# EAGLE design rutten_motor_board (EAGLE 6.5.0)
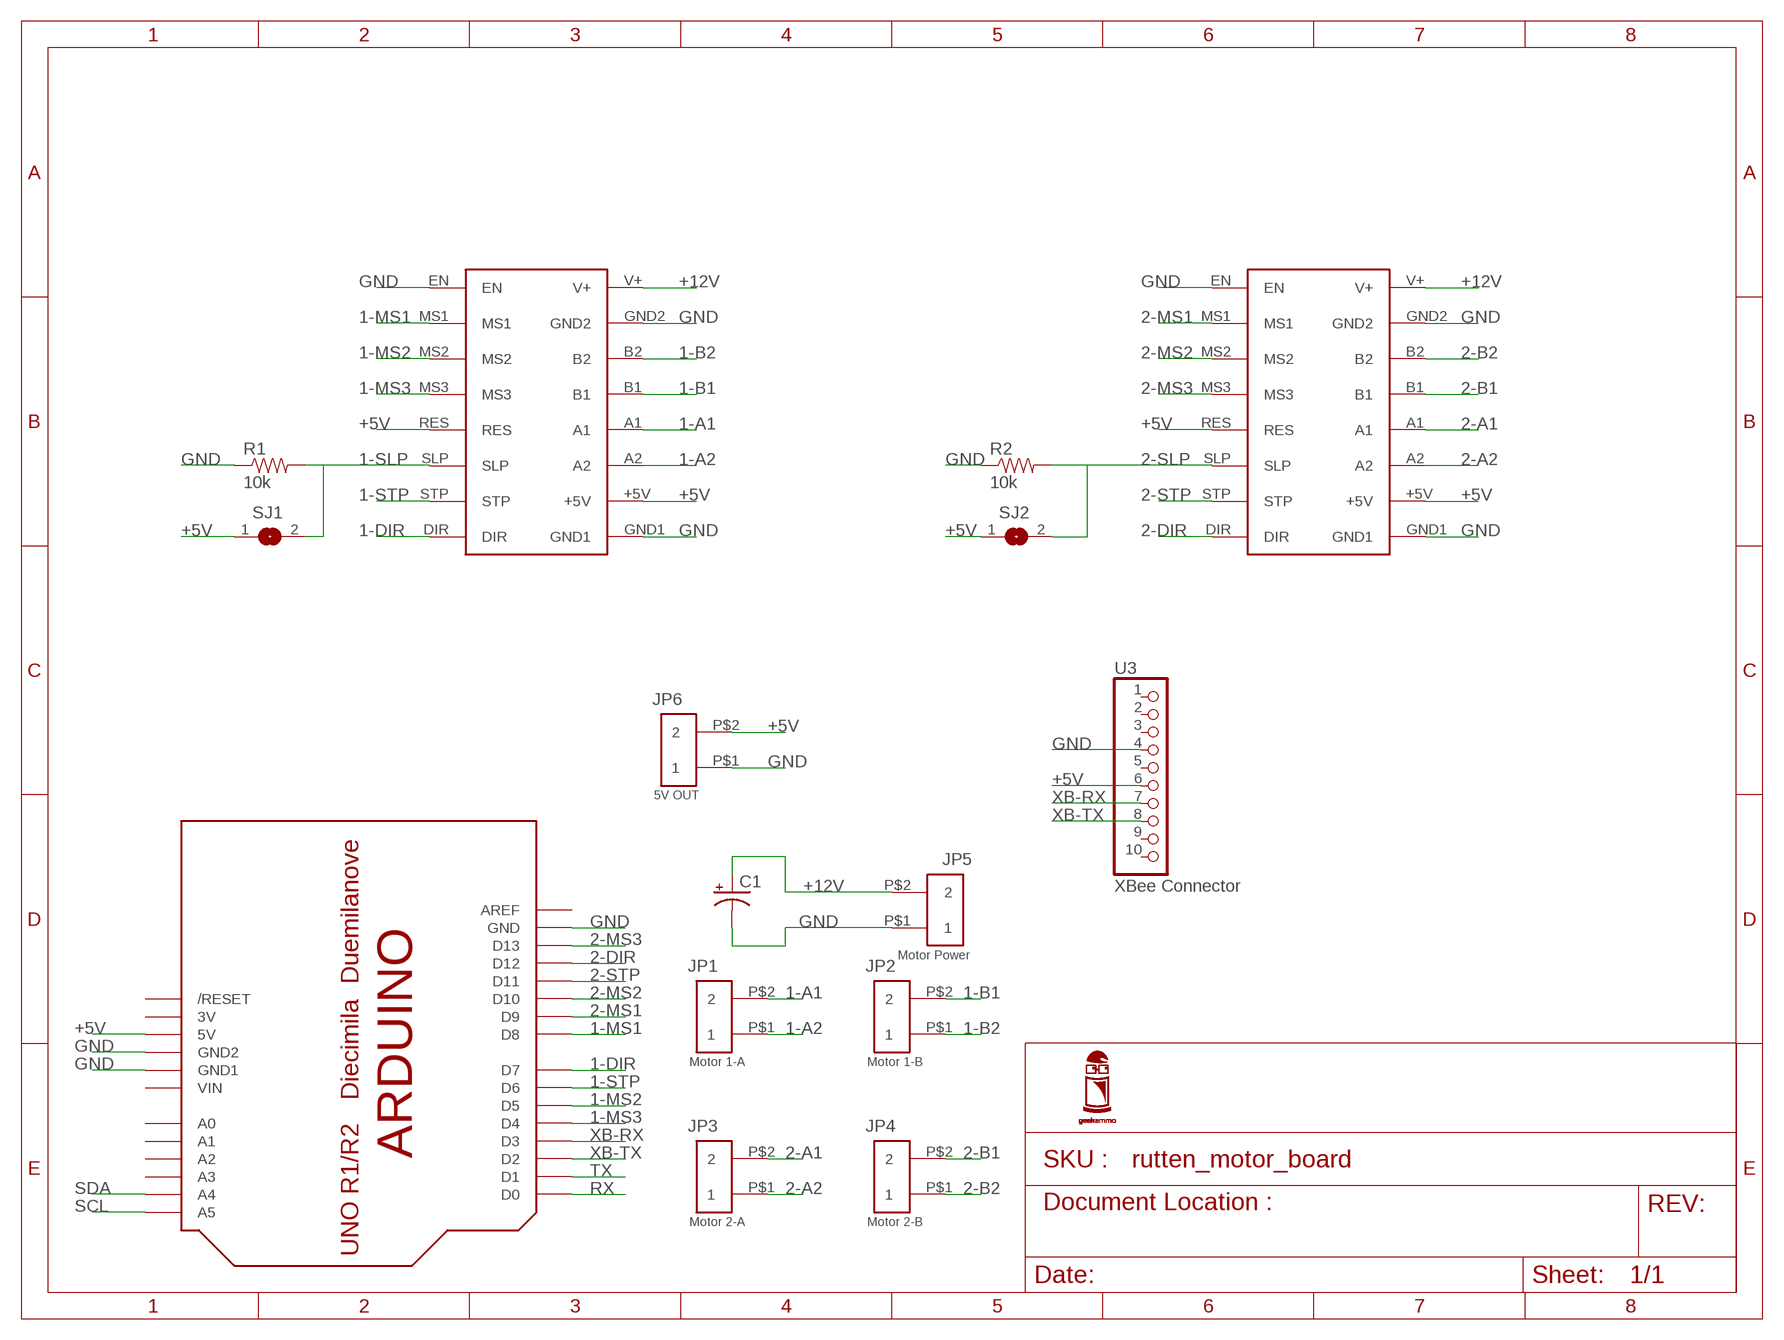
[diagram p0: schematic, sheet 1]

## Parts
C1  CAP_POLPTH2  [CPOL-RADIAL-10UF-25V]
JP1  Motor 1-A  SCREWTERM-2  [SCREW_TERM-200MIL-2]
JP2  Motor 1-B  SCREWTERM-2  [SCREW_TERM-200MIL-2]
JP3  Motor 2-A  SCREWTERM-2  [SCREW_TERM-200MIL-2]
JP4  Motor 2-B  SCREWTERM-2  [SCREW_TERM-200MIL-2]
JP5  Motor Power  SCREWTERM-2  [SCREW_TERM-200MIL-2]
JP6  5V OUT  SCREWTERM-2  [SCREW_TERM-200MIL-2]
R1  10k  RESISTORPTH-1/4W  [AXIAL-0.4]
R2  10k  RESISTORPTH-1/4W  [AXIAL-0.4]
SJ1  SJ  [SJ]
SJ2  SJ  [SJ]
U1  A4988_STEP_STICK  [A9488_STEP_STICK]
U2  A4988_STEP_STICK  [A9488_STEP_STICK]
U3  XBee Connector  PINHD-1X10  [1X10-BIG]
U$1  ARDUINOUNO  [ARDUINO]

## Nets
1-A1: JP1.P$2 U1.A1
1-A2: JP1.P$1 U1.A2
1-B1: JP2.P$2 U1.B1
1-B2: JP2.P$1 U1.B2
1-DIR: U1.DIR U$1.D7
1-MS1: U1.MS1 U$1.D8
1-MS2: U1.MS2 U$1.D5
1-MS3: U1.MS3 U$1.D4
1-SLP: R1.P$2 SJ1.2 U1.SLP
1-STP: U1.STP U$1.D6
2-A1: JP3.P$2 U2.A1
2-A2: JP3.P$1 U2.A2
2-B1: JP4.P$2 U2.B1
2-B2: JP4.P$1 U2.B2
2-DIR: U2.DIR U$1.D12
2-MS1: U2.MS1 U$1.D9
2-MS2: U2.MS2 U$1.D10
2-MS3: U2.MS3 U$1.D13
2-SLP: R2.P$2 SJ2.2 U2.SLP
2-STP: U2.STP U$1.D11
+5V: JP6.P$2 SJ1.1 SJ2.1 U1.+5V U1.RES U2.+5V U2.RES U3.6 U$1.5V
+12V: C1.1(+) JP5.P$2 U1.V+ U2.V+
GND: C1.2(-) JP5.P$1 JP6.P$1 R1.P$1 R2.P$1 U1.EN U1.GND1 U1.GND2 U2.EN U2.GND1 U2.GND2 U3.4 U$1.GND U$1.GND1 U$1.GND2
RX: U$1.D0
SCL: U$1.A5
SDA: U$1.A4
TX: U$1.D1
XB-RX: U3.7 U$1.D3
XB-TX: U3.8 U$1.D2
Unconnected: U3.1 U3.2 U3.3 U3.5 U3.9 U3.10 U$1.A0 U$1.A1 U$1.A2 U$1.A3 U$1.AREF U$1.RESET(/RESET)

## Power pins joined to a net without a drawn wire
5V: U$1.3V
VIN: U$1.VIN

## Library data of the parts
C1 = SparkFun-Passives:CAP_POL: Capacitor Polarized These are standard SMD and PTH capacitors. Normally 10uF, 47uF, and 100uF in electrolytic and tantalum varieties. Always verify the external diameter of the through hole cap, it varies with capacity, voltage, and manufacturer. The EIA devices should be standard.
JP1-JP6 = screwterms:SCREWTERM-2
R1 R2 = SparkFun-Passives:RESISTOR: Resistor Basic schematic elements and footprints for 0603, 1206, and PTH resistors.
SJ1 SJ2 = jumper:SJ: SMD solder JUMPER
U1 U2 = Custom:A4988_STEP_STICK
U3 = adafruit:PINHD-1X10: Pin header 1x10 0.1" spacing With round pins
U$1 = adafruit:ARDUINO: Arduino Diecimila/Duemilanove Make a shield with ease, this package has all the named pins as well as the two mounting drill holes and an outline of the USB and DC power connector. The outline is on the DIMENSION layer, so if your board house uses it they will cut the outline to match. http://www.ladyada.net/library/pcb/eaglelibrary.html

## Board
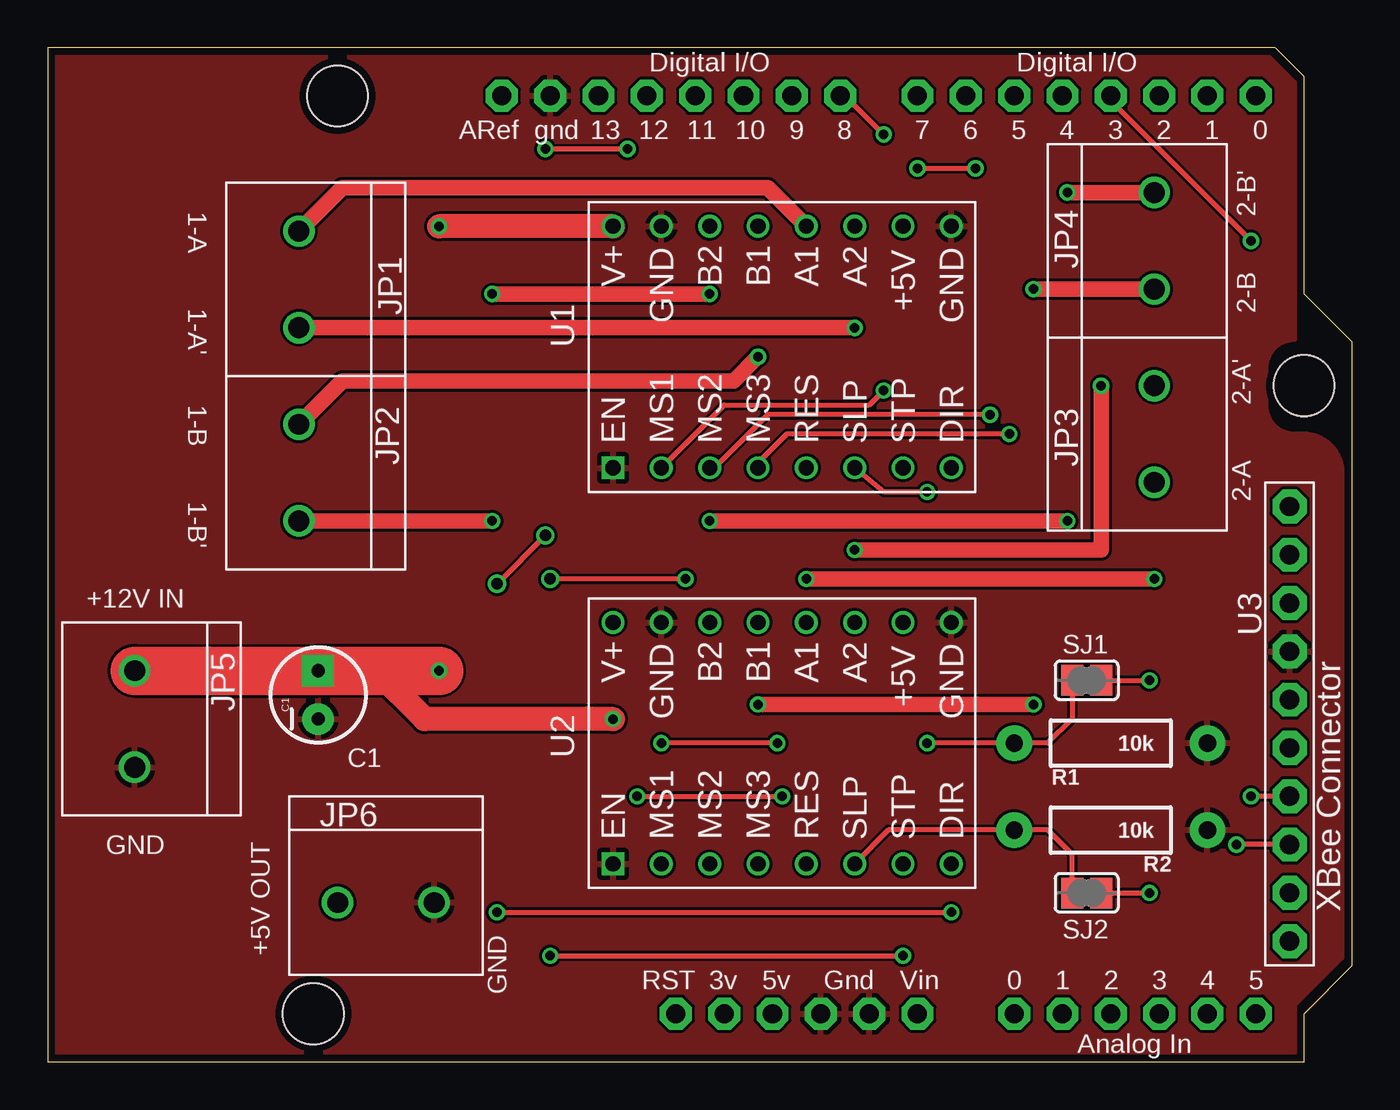
[diagram p1: board, top side]
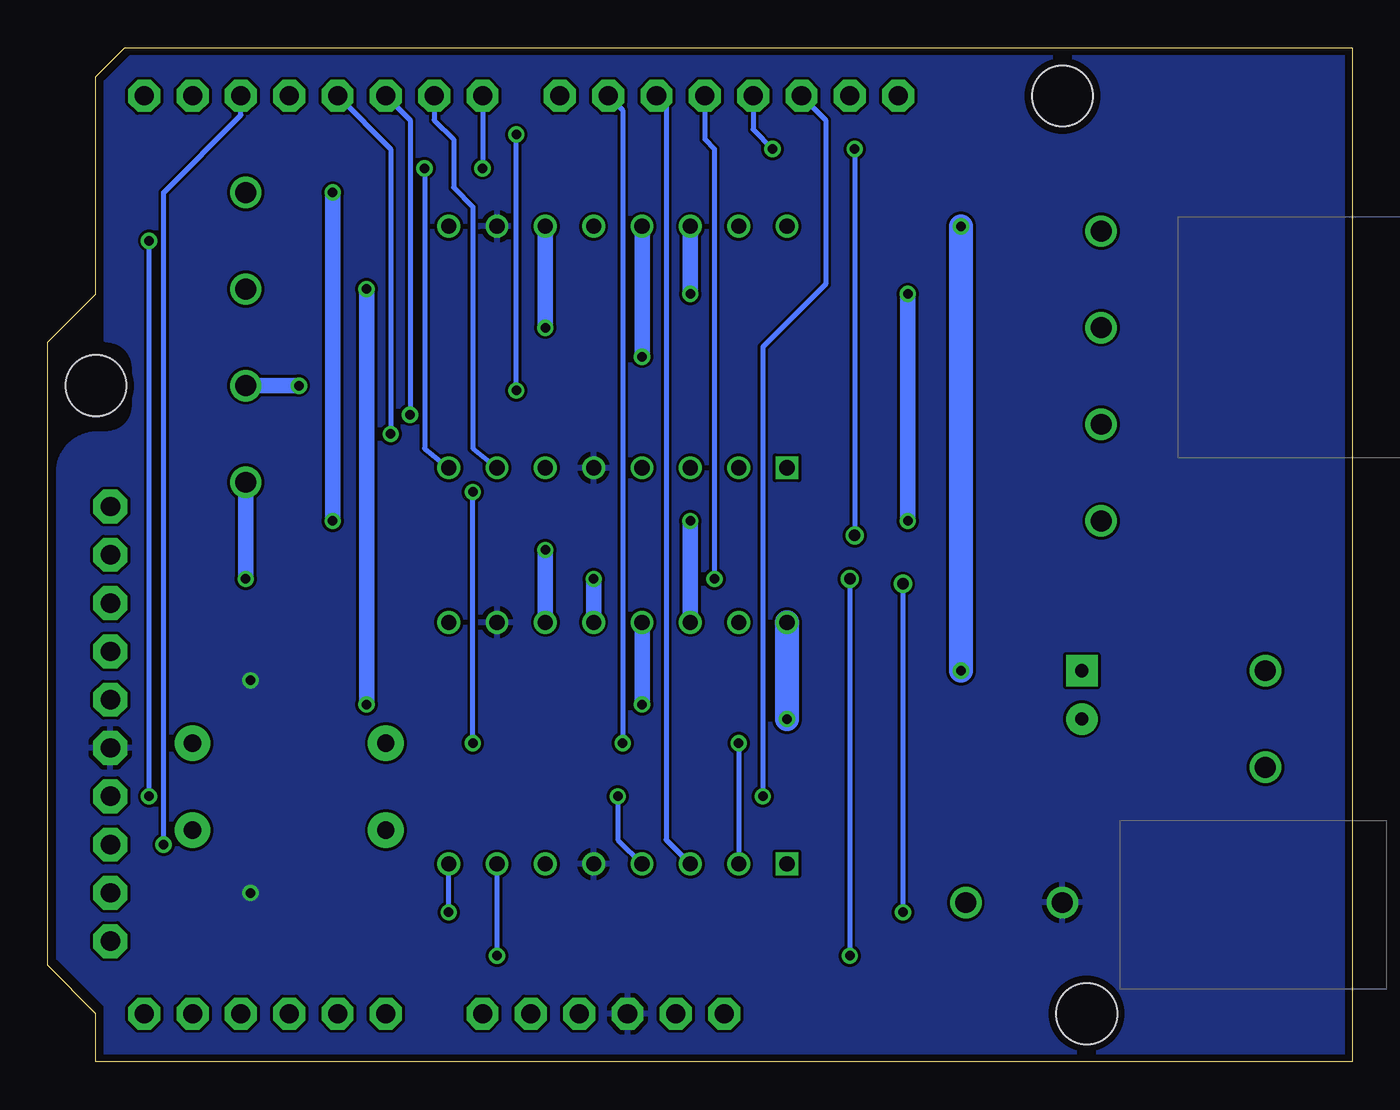
[diagram p2: board, bottom side, seen from below]

Size 68.58 x 53.34 mm. Coordinates in mm from the lower left corner, seen from the top.
Copper layers (1*16): Top 0.0356mm / dielectric 1.5011mm / Bottom 0.0356mm
Design rules "oshpark-2layer *": minimum track width 6mil, minimum drill 13mil, track to track 6mil, track to pad 6mil, pad to pad 6mil, via to via 6mil, smd to smd 6mil, copper to edge 15mil, drill to drill 6mil, minimum pad ring 7mil, minimum via ring 7mil, stop-mask expansion 2.5mil, vias tented up to drill 17mil, thermal gap 10mil

### Footprints (pad centres in the part's own frame; a part is rotated, then mirrored left to right if it is on the bottom)
CPOL-RADIAL-10UF-25V = drill 0.7 pad 1.651 square: 1 1.27,0 | drill 0.7 pad 1.651: 2 -1.27,0
SCREW_TERM-200MIL-2 = drill 1.1: P$1 2.54,0; P$2 -2.54,0
AXIAL-0.4 = drill 0.9 pad 1.88: P$1 -5.08,0; P$2 5.08,0
SJ = smd 1.168 x 1.6: 1 -0.762,0; 2 0.762,0
A9488_STEP_STICK = drill 0.8: +5V 6.35,-6.35; A1 6.35,-1.27; A2 6.35,-3.81; B1 6.35,1.27; B2 6.35,3.81; DIR -6.35,-8.89; GND1 6.35,-8.89; GND2 6.35,6.35; MS1 -6.35,6.35; MS2 -6.35,3.81; MS3 -6.35,1.27; RES -6.35,-1.27; SLP -6.35,-3.81; STP -6.35,-6.35; V+ 6.35,8.89 | drill 0.8 square: EN -6.35,8.89
1X10-BIG = drill 1.016 pad 1.778 octagon: 1 -11.43,0; 2 -8.89,0; 3 -6.35,0; 4 -3.81,0; 5 -1.27,0; 6 1.27,0; 7 3.81,0; 8 6.35,0; 9 8.89,0; 10 11.43,0
ARDUINO = drill 1 pad 1.676 octagon: 3V 35.56,2.54; 5V 38.1,2.54; A0 50.8,2.54; A1 53.34,2.54; A2 55.88,2.54; A3 58.42,2.54; A4 60.96,2.54; A5 63.5,2.54; AREF 23.876,50.8; D0 63.5,50.8; D1 60.96,50.8; D2 58.42,50.8; D3 55.88,50.8; D4 53.34,50.8; D5 50.8,50.8; D6 48.26,50.8; D7 45.72,50.8; D8 41.656,50.8; D9 39.116,50.8; D10 36.576,50.8; D11 34.036,50.8; D12 31.496,50.8; D13 28.956,50.8; GND 26.416,50.8; GND1 43.18,2.54; GND2 40.64,2.54; RESET 33.02,2.54; VIN 45.72,2.54 | hole 3.2: 15.24,50.8; 66.04,35.56; 13.97,2.54

### Placement (x,y rotation side)
C1  14.22,19.3 90 top
JP1  13.21,41.15 270 top
JP2  13.21,30.99 270 top
JP3  58.17,33.02 90 top
JP4  58.17,43.18 90 top
JP5  4.57,18.03 270 top
JP6  17.78,8.38 0 top
R1  55.88,16.76 180 top
R2  55.88,12.19 180 top
SJ1  54.61,20.07 180 top
SJ2  54.61,8.89 180 top
U1  38.61,37.59 90 top
U2  38.61,16.76 90 top
U3  65.28,17.78 270 top
U$1  0,0 0 top

### Tracks (layer width: path | path; a pad name or v marks a point on that pad's centre or on a via)
1-A1
  Top 0.813: JP1.P$2 15.49,45.97 37.85,45.97 U1.A1
1-A2  (via drill 0.5)
  Top 0.813: JP1.P$1 v42.42,38.61
  Bottom 0.813: v42.42,38.61 U1.A2
1-B1  (via drill 0.5)
  Top 0.813: JP2.P$2 15.49,35.81 36.07,35.81 v37.34,37.08
  Bottom 0.813: v37.34,37.08 U1.B1
1-B2  (via drill 0.5)
  Top 0.813: v34.8,40.39 v23.37,40.39 | v23.37,28.45 JP2.P$1
  Bottom 0.813: U1.B2 v34.8,40.39 | v23.37,40.39 v23.37,28.45
1-DIR  (via drill 0.5 pad 0.41)
  Top 0.254: v45.72,46.99 v48.77,46.99
  Bottom 0.254: U$1.D7 v45.72,46.99 | v48.77,46.99 48.77,32.26 U1.DIR
1-MS1  (via drill 0.5 pad 0.41)
  Top 0.254: U1.MS1 35.56,34.54 43.18,34.54 v43.94,35.31 | v43.94,48.77 41.91,50.8 U$1.D8
  Bottom 0.254: v43.94,35.31 v43.94,48.77
1-MS2  (via drill 0.5)
  Top 0.254: v49.53,34.04 37.85,34.04 35.05,31.24 U1.MS2
  Bottom 0.254: U$1.D5 49.53,49.53 v49.53,34.04
1-MS3  (via drill 0.5)
  Top 0.254: v50.55,33.02 38.86,33.02 37.34,31.5 U1.MS3
  Bottom 0.254: U$1.D4 50.55,48.01 v50.55,33.02
1-SLP  (via drill 0.5 pad 0.41)
  Top 0.254: v46.23,16.76 R1.P$2 52.58,16.76 53.85,18.03 SJ1.2 | v46.23,29.97 43.94,29.97 U1.SLP
  Bottom 0.254: v46.23,16.76 v46.23,29.97
1-STP
  Bottom 0.254: U1.STP 46.23,32.26 46.23,44.96 47.24,45.97 47.24,48.51 48.26,49.53 U$1.D6
2-A1  (via drill 0.5)
  Top 0.813: v58.17,25.4 v39.88,25.4
  Bottom 0.813: JP3.P$2 v58.17,25.4 | v39.88,25.4 U2.A1
2-A2  (via drill 0.5, 0.5 pad 0.41)
  Top 0.813: v42.42,26.92 55.37,26.92 v55.37,35.56
  Bottom 0.813: v42.42,26.92 U2.A2 | v55.37,35.56 JP3.P$1
2-B1  (via drill 0.5 pad 0.41)
  Top 0.813: v51.82,18.8 v37.34,18.8 | JP4.P$2 v51.82,40.64
  Bottom 0.813: v51.82,40.64 v51.82,18.8 | v37.34,18.8 U2.B1
2-B2  (via drill 0.5, 0.5 pad 0.41)
  Top 0.813: v53.59,28.45 v34.8,28.45 | JP4.P$1 v53.59,45.72
  Bottom 0.813: v53.59,45.72 v53.59,28.45 | v34.8,28.45 U2.B2
2-DIR  (via drill 0.5 pad 0.41, 0.6, 0.6 pad 0.41)
  Top 0.254: v30.48,48.01 v26.16,48.01 | v23.62,7.87 v47.5,7.87 | v26.16,27.69 v23.62,25.15
  Bottom 0.254: U$1.D12 31.5,49.02 v30.48,48.01 | v26.16,48.01 v26.16,27.69 | v23.62,25.15 v23.62,7.87 | v47.5,7.87 U2.DIR
2-MS1  (via drill 0.5)
  Top 0.254: v38.35,16.76 v32.26,16.76
  Bottom 0.254: U$1.D9 38.35,50.04 v38.35,16.76 | v32.26,16.76 U2.MS1
2-MS2
  Bottom 0.254: U$1.D10 36.07,50.29 36.07,11.68 U2.MS2
2-MS3  (via drill 0.5)
  Top 0.254: v30.99,13.97 v38.61,13.97
  Bottom 0.254: U$1.D13 27.69,49.53 27.69,40.89 30.99,37.59 v30.99,13.97 | v38.61,13.97 38.61,11.68 U2.MS3
2-SLP
  Top 0.254: U2.SLP 44.2,12.19 R2.P$2 52.58,12.19 53.85,10.92 SJ2.2
2-STP  (via drill 0.5 pad 0.41, 0.6 pad 0.41)
  Top 0.254: v33.53,25.4 v26.42,25.4 | v26.42,5.59 v44.96,5.59
  Bottom 0.254: U$1.D11 34.04,48.51 33.53,48.01 v33.53,25.4 | v26.42,25.4 v26.42,5.59 | v44.96,5.59 U2.STP
+5V  (via drill 0.5 pad 0.41)
  Top 0.254: SJ2.1 v57.91,8.89 | SJ1.1 v57.91,20.07
  pour Bottom: 0.5,53 64,53 65.5,51.5 65.5,38 arc90 64,36.5 64,35.5 64,34.5 arc90 65.5,33 66,33 arc-90 68,31 68,5.5 65.5,3 65.5,0.5 0.5,0.5
+12V  (via drill 0.5, 0.5 pad 0.41)
  Top 1.27: U1.V+ v20.57,43.94 | v29.72,18.03 19.81,18.03 17.27,20.57
  Top 2.54: v20.57,20.57 17.27,20.57 C1.1 JP5.P$2
  Bottom 1.27: v20.57,43.94 v20.57,20.57 | U2.V+ v29.72,18.03
GND
  pour Top: 0.5,53 64,53 65.5,51.5 65.5,38 arc90 64,36.5 64,35.5 64,34.5 arc90 65.5,33 66,33 arc-90 68,31 68,6 68,5.5 65.5,3 65.5,0.5 0.5,0.5
XB-RX  (via drill 0.5)
  Top 0.254: U3.7 v63.25,13.97 | v63.25,43.18 55.88,50.55 U$1.D3
  Bottom 0.254: v63.25,13.97 v63.25,43.18
XB-TX  (via drill 0.5)
  Top 0.254: U3.8 v62.48,11.43
  Bottom 0.254: v62.48,11.43 62.48,45.72 58.42,49.78 U$1.D2

### Text on the board
tNames: 1-A | 2-B' | 1-A' | 2-B | 1-B | 2-A' | 1-B' | 2-A | +12V IN | C1 | GND | +5V OUT | GND